# EAGLE design UMN_HASP_2015_GPS-IMU_Board (EAGLE 6.5.0)

## Sheet 1 of 3: GPS
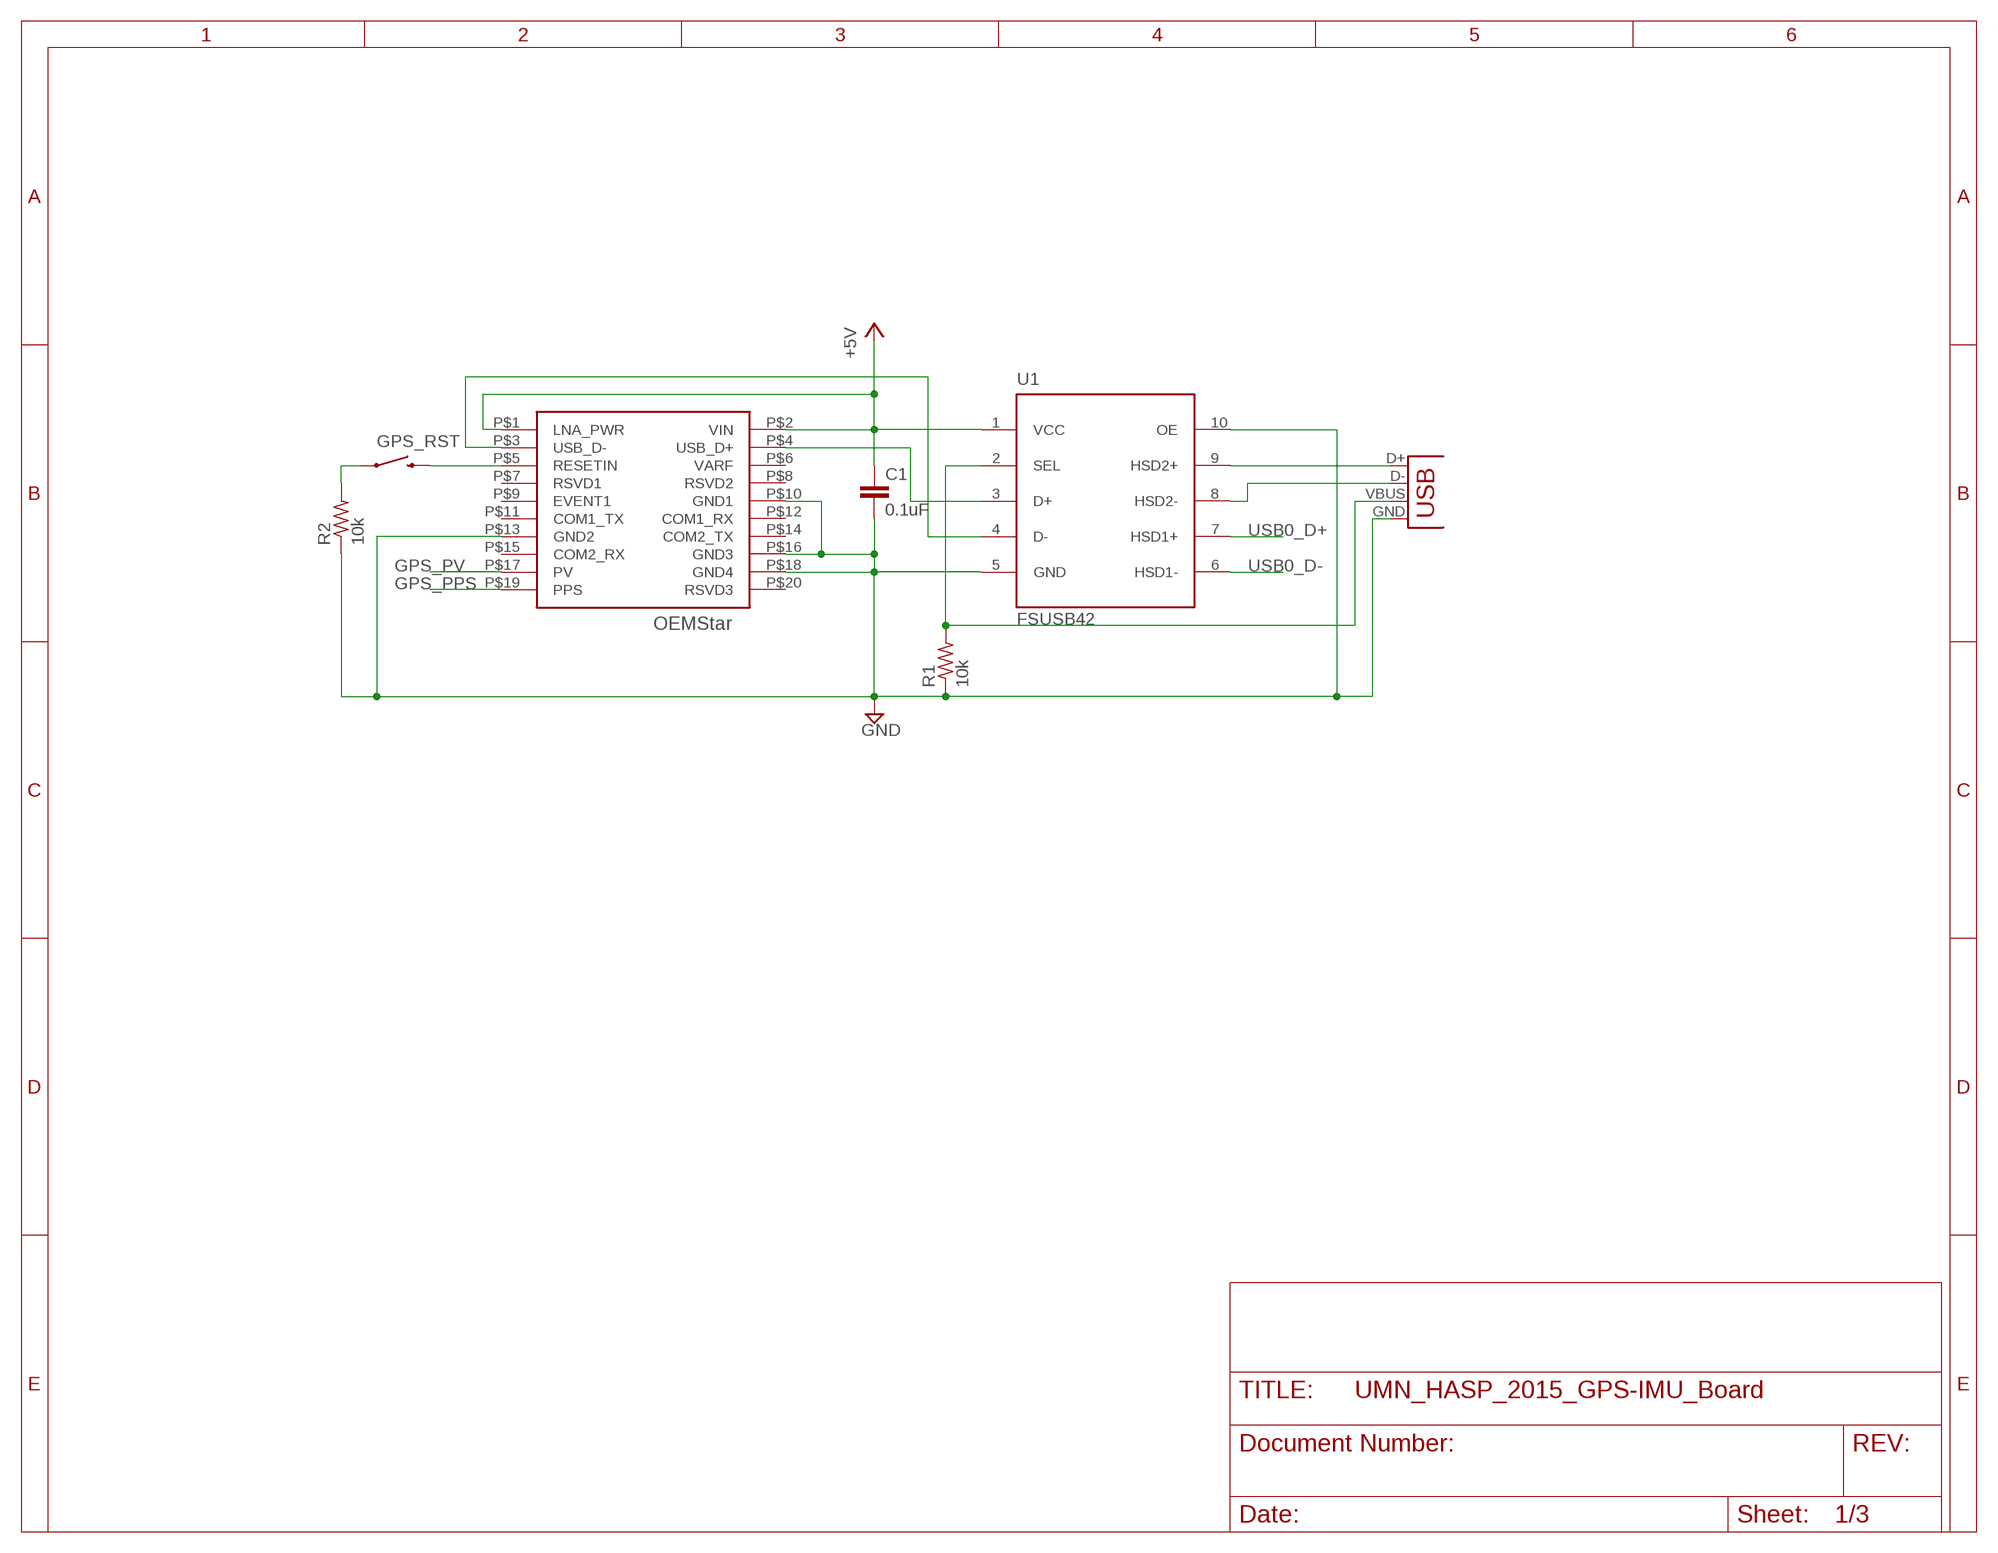
[diagram p0: schematic, sheet 1]

### Parts
C1  0.1uF  C-EUC1206K  [C1206K]
GPS_RST  SWITCH-MOMENTARY-2PTH  [TACTILE-PTH]
J6  USB-B  USBPTH  [USB-B-PTH]
R1  10k  R-US_R1206  [R1206]
R2  10k  R-US_R1206  [R1206]
U1  FSUSB42  [MSOP10]
U$2  OEMSTAR  [OEMSTAR]

### Nets
+5V: C1.1 U1.1(VCC) U$2.P$1(LNA_PWR) U$2.P$2(VIN) ; also sheet 2,3
GND: C1.2 J6.GND R1.1 R2.1 U1.5(GND) U1.10(OE) U$2.P$10(GND1) U$2.P$13(GND2) U$2.P$16(GND3) U$2.P$18(GND4) ; also sheet 2,3
GPS_PPS: U$2.P$19(PPS) ; also sheet 3
GPS_PV: U$2.P$17(PV) ; also sheet 3
N$5: GPS_RST.1 R2.2
N$7: J6.D- U1.8(HSD2-)
N$8: J6.VBUS R1.2 U1.2(SEL)
N$9: GPS_RST.3 U$2.P$5(RESETIN)
N$10: U1.3(D+) U$2.P$4(USB_D+)
N$11: U1.4(D-) U$2.P$3(USB_D-)
N$14: J6.D+ U1.9(HSD2+)
USB0_D+: U1.7(HSD1+) ; also sheet 3
USB0_D-: U1.6(HSD1-) ; also sheet 3
Unconnected: U$2.P$6(VARF) U$2.P$7(RSVD1) U$2.P$8(RSVD2) U$2.P$9(EVENT1) U$2.P$11(COM1_TX) U$2.P$12(COM1_RX) U$2.P$14(COM2_TX) U$2.P$15(COM2_RX) U$2.P$20(RSVD3)

## Sheet 2 of 3: IMU
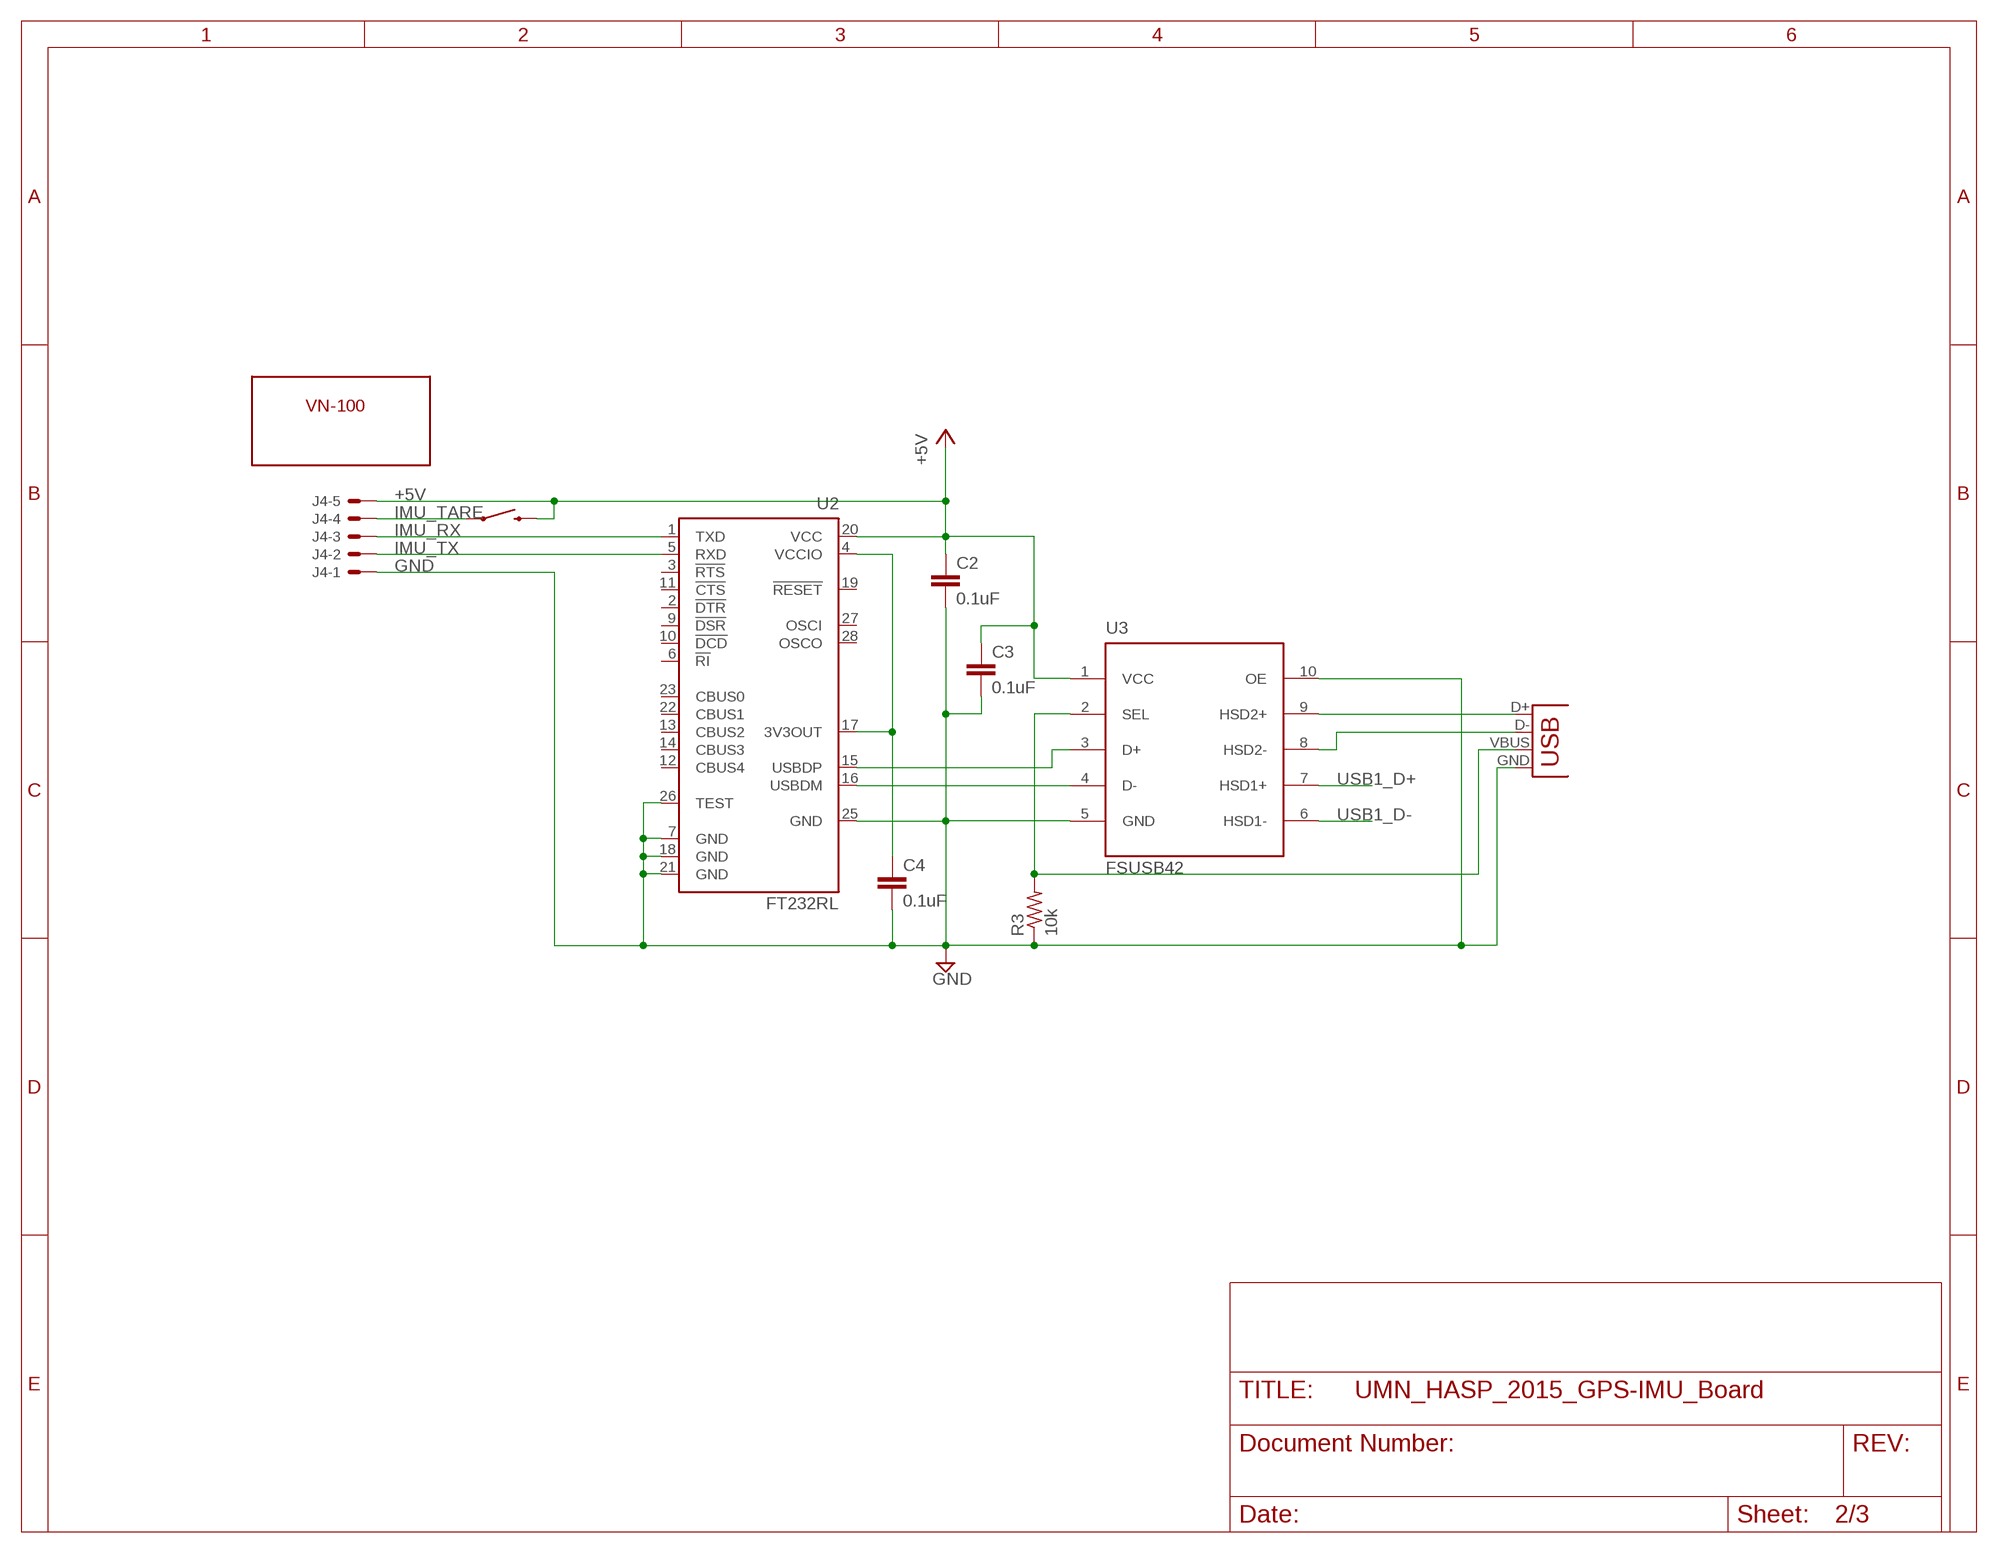
[diagram p1: schematic, sheet 2]

### Parts
C2  0.1uF  C-EUC1206K  [C1206K]
C3  0.1uF  C-EUC1206K  [C1206K]
C4  0.1uF  C-EUC1206K  [C1206K]
IMU_TARE  SWITCH-MOMENTARY-2PTH  [TACTILE-PTH]
J4  C-GRID-05-70553  [70553-05]
J5  USB-B  USBPTH  [USB-B-PTH]
R3  10k  R-US_R1206  [R1206]
U2  FT232RL  [SSOP28]
U3  FSUSB42  [MSOP10]
U$3  VN-100  [VN-100]

### Nets
+5V: C2.1 C3.1 IMU_TARE.3 J4.5 U2.20(VCC) U3.1(VCC) ; also sheet 1,3
GND: C2.2 C3.2 C4.2 J4.1 J5.GND R3.1 U2.7(GND) U2.18(GND) U2.21(GND) U2.25(GND) U2.26(TEST) U3.5(GND) U3.10(OE) ; also sheet 1,3
IMU_RX: J4.3 U2.1(TXD)
IMU_TARE: IMU_TARE.1 J4.4
IMU_TX: J4.2 U2.5(RXD)
N$6: J5.D+ U3.9(HSD2+)
N$12: U2.16(USBDM) U3.4(D-)
N$13: U2.15(USBDP) U3.3(D+)
N$15: J5.D- U3.8(HSD2-)
N$16: J5.VBUS R3.2 U3.2(SEL)
N$17: C4.1 U2.4(VCCIO) U2.17(3V3OUT)
USB1_D+: U3.7(HSD1+) ; also sheet 3
USB1_D-: U3.6(HSD1-) ; also sheet 3
Unconnected: U2.2(!DTR) U2.3(!RTS) U2.6(!RI) U2.9(!DSR) U2.10(!DCD) U2.11(!CTS) U2.12(CBUS4) U2.13(CBUS2) U2.14(CBUS3) U2.19(!RESET) U2.22(CBUS1) U2.23(CBUS0) U2.27(OSCI) U2.28(OSCO)

## Sheet 3 of 3: PC/104
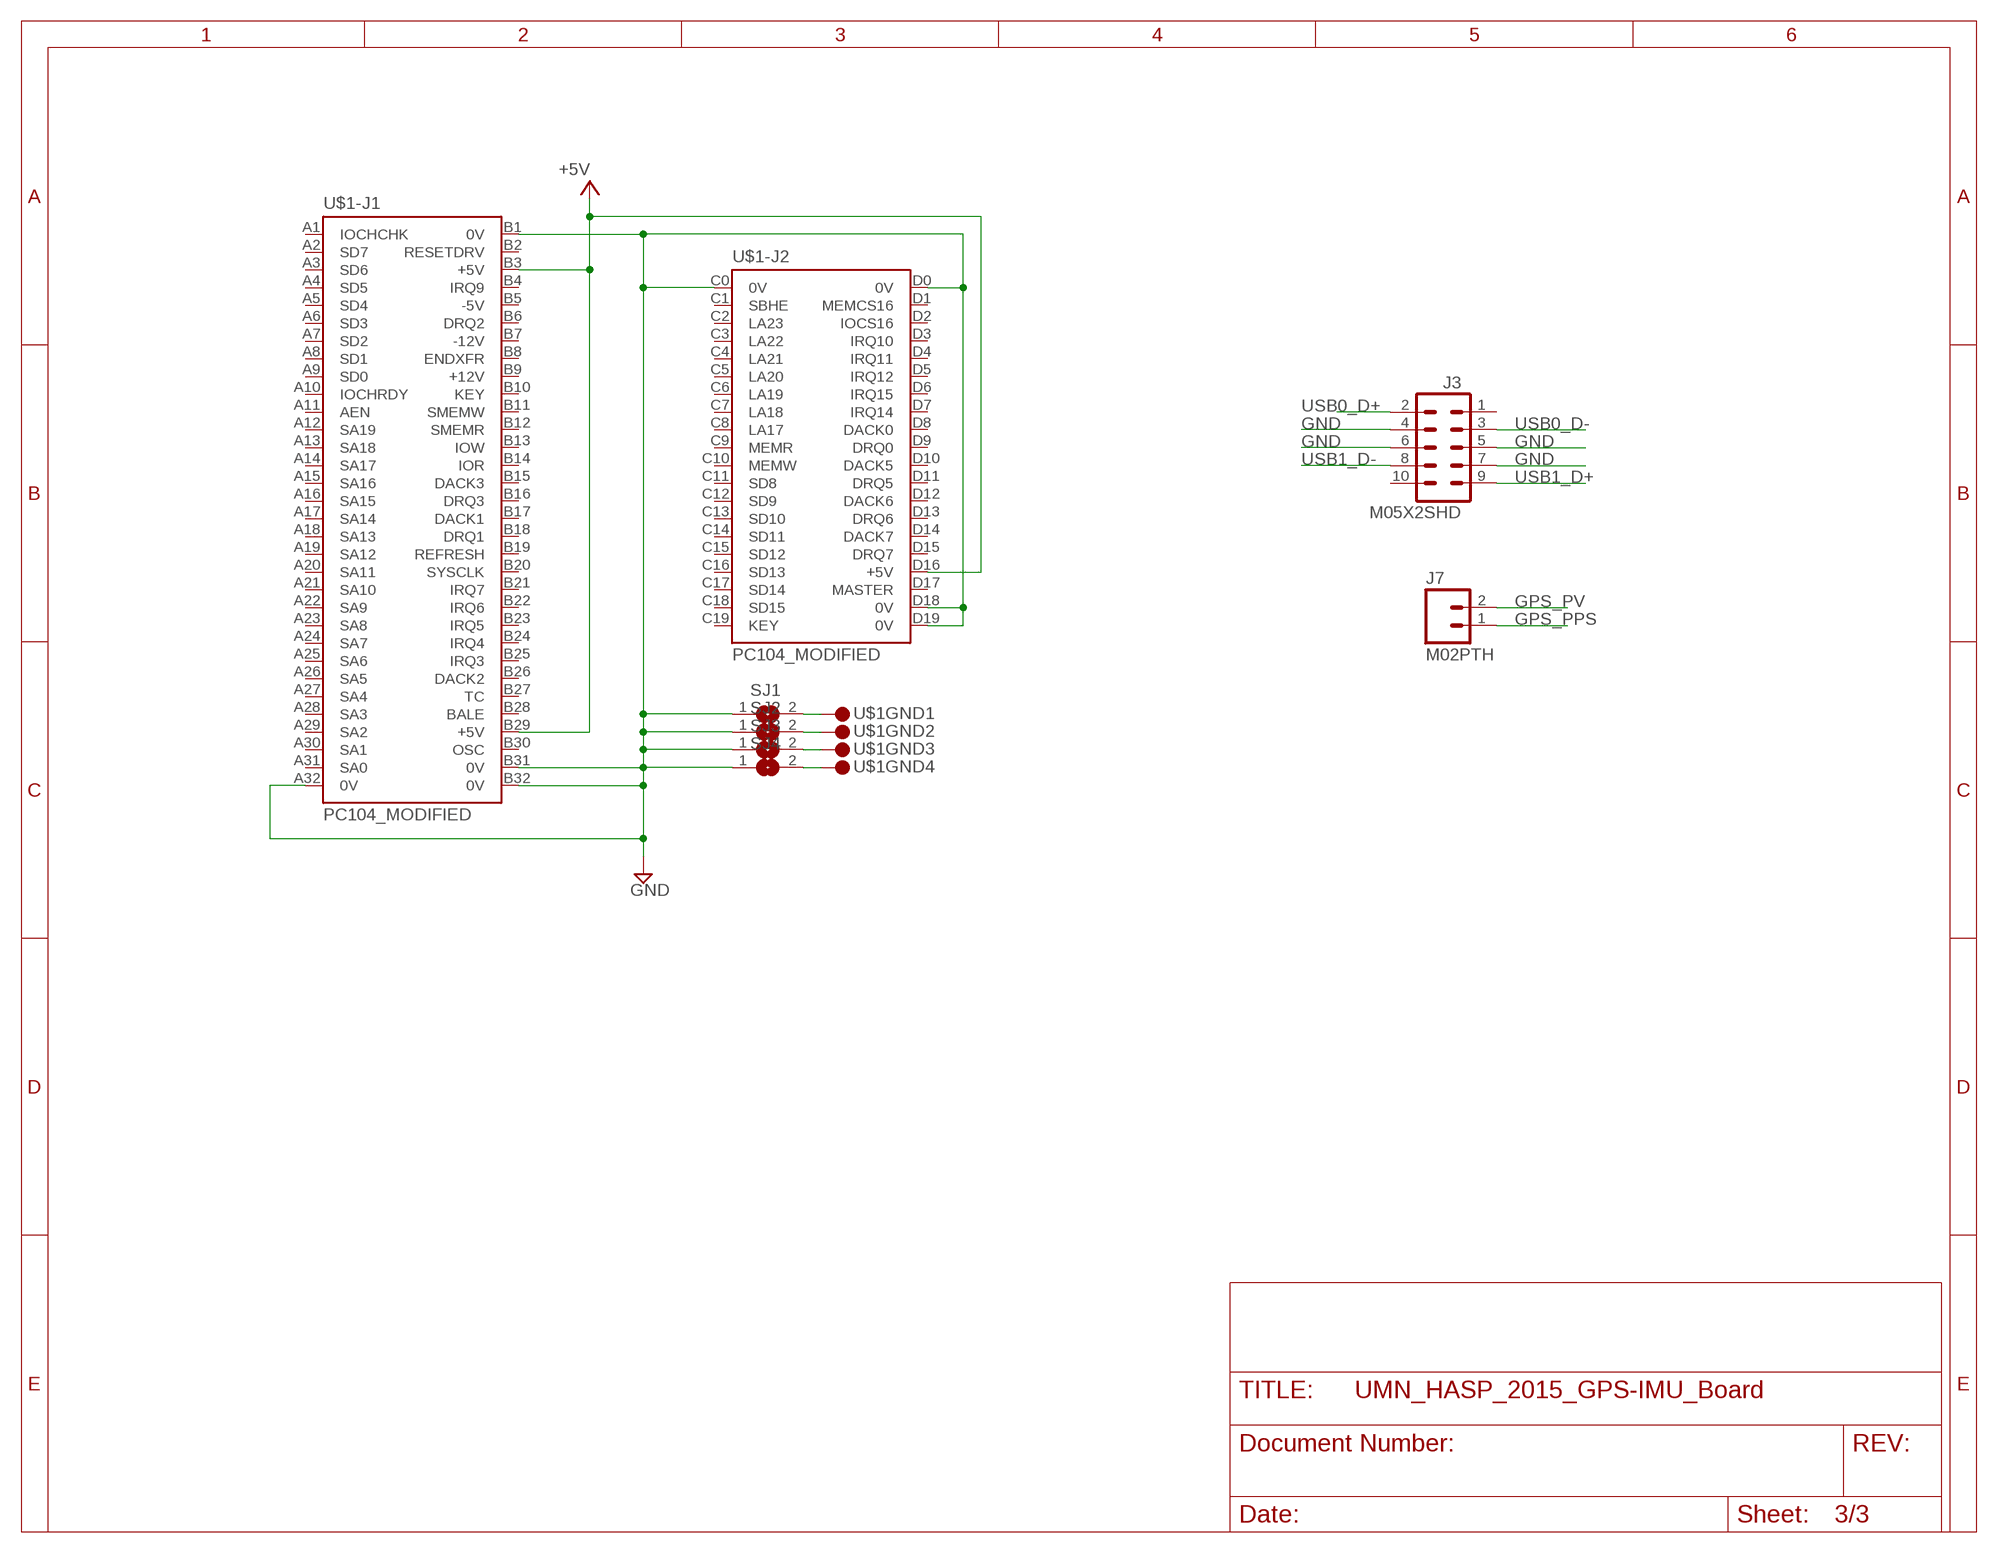
[diagram p2: schematic, sheet 3]

### Parts
J3  M05X2SHD  [2X5-SHROUDED]
J7  M02PTH  [1X02]
SJ1  SJ  [SJ]
SJ2  SJ  [SJ]
SJ3  SJ  [SJ]
SJ4  SJ  [SJ]
U$1  PC104_MODIFIED  [PC104_MODIFIED]

### Nets
+5V: U$1.B3(-J1:+5V) U$1.B29(-J1:+5V) U$1.D16(-J2:+5V) ; also sheet 1,2
GND: J3.4 J3.5 J3.6 J3.7 SJ1.1 SJ2.1 SJ3.1 SJ4.1 U$1.A32(-J1:0V) U$1.B1(-J1:0V) U$1.B31(-J1:0V) U$1.B32(-J1:0V) U$1.C0(-J2:0V) U$1.D0(-J2:0V) U$1.D18(-J2:0V) U$1.D19(-J2:0V) ; also sheet 1,2
GPS_PPS: J7.1 ; also sheet 1
GPS_PV: J7.2 ; also sheet 1
N$1: SJ1.2 U$1.GND@1
N$2: SJ2.2 U$1.GND@2
N$3: SJ3.2 U$1.GND@3
N$4: SJ4.2 U$1.GND@4
USB0_D+: J3.2 ; also sheet 1
USB0_D-: J3.3 ; also sheet 1
USB1_D+: J3.9 ; also sheet 2
USB1_D-: J3.8 ; also sheet 2
Unconnected: J3.1 J3.10 U$1.A1(-J1:IOCHCHK) U$1.A2(-J1:SD7) U$1.A3(-J1:SD6) U$1.A4(-J1:SD5) U$1.A5(-J1:SD4) U$1.A6(-J1:SD3) U$1.A7(-J1:SD2) U$1.A8(-J1:SD1) U$1.A9(-J1:SD0) U$1.A10(-J1:IOCHRDY) U$1.A11(-J1:AEN) U$1.A12(-J1:SA19) U$1.A13(-J1:SA18) U$1.A14(-J1:SA17) U$1.A15(-J1:SA16) U$1.A16(-J1:SA15) U$1.A17(-J1:SA14) U$1.A18(-J1:SA13) U$1.A19(-J1:SA12) U$1.A20(-J1:SA11) U$1.A21(-J1:SA10) U$1.A22(-J1:SA9) U$1.A23(-J1:SA8) U$1.A24(-J1:SA7) U$1.A25(-J1:SA6) U$1.A26(-J1:SA5) U$1.A27(-J1:SA4) U$1.A28(-J1:SA3) U$1.A29(-J1:SA2) U$1.A30(-J1:SA1) U$1.A31(-J1:SA0) U$1.B2(-J1:RESETDRV) U$1.B4(-J1:IRQ9) U$1.B5(-J1:-5V) U$1.B6(-J1:DRQ2) U$1.B7(-J1:-12V) U$1.B8(-J1:ENDXFR) U$1.B9(-J1:+12V) U$1.B10(-J1:KEY) U$1.B11(-J1:SMEMW) U$1.B12(-J1:SMEMR) U$1.B13(-J1:IOW) U$1.B14(-J1:IOR) U$1.B15(-J1:DACK3) U$1.B16(-J1:DRQ3) U$1.B17(-J1:DACK1) U$1.B18(-J1:DRQ1) U$1.B19(-J1:REFRESH) U$1.B20(-J1:SYSCLK) U$1.B21(-J1:IRQ7) U$1.B22(-J1:IRQ6) U$1.B23(-J1:IRQ5) U$1.B24(-J1:IRQ4) U$1.B25(-J1:IRQ3) U$1.B26(-J1:DACK2) U$1.B27(-J1:TC) U$1.B28(-J1:BALE) U$1.B30(-J1:OSC) U$1.C1(-J2:SBHE) U$1.C2(-J2:LA23) U$1.C3(-J2:LA22) U$1.C4(-J2:LA21) U$1.C5(-J2:LA20) U$1.C6(-J2:LA19) U$1.C7(-J2:LA18) U$1.C8(-J2:LA17) U$1.C9(-J2:MEMR) U$1.C10(-J2:MEMW) U$1.C11(-J2:SD8) U$1.C12(-J2:SD9) U$1.C13(-J2:SD10) U$1.C14(-J2:SD11) U$1.C15(-J2:SD12) U$1.C16(-J2:SD13) U$1.C17(-J2:SD14) U$1.C18(-J2:SD15) U$1.C19(-J2:KEY) U$1.D1(-J2:MEMCS16) U$1.D2(-J2:IOCS16) U$1.D3(-J2:IRQ10) U$1.D4(-J2:IRQ11) U$1.D5(-J2:IRQ12) U$1.D6(-J2:IRQ15) U$1.D7(-J2:IRQ14) U$1.D8(-J2:DACK0) U$1.D9(-J2:DRQ0) U$1.D10(-J2:DACK5) U$1.D11(-J2:DRQ5) U$1.D12(-J2:DACK6) U$1.D13(-J2:DRQ6) U$1.D14(-J2:DACK7) U$1.D15(-J2:DRQ7) U$1.D17(-J2:MASTER)

## Library data of the parts
C1-C4 = resistor:C-EU: CAPACITOR, European symbol
GPS_RST IMU_TARE = SparkFun-Electromechanical:SWITCH-MOMENTARY-2: Various NO switches- pushbuttons, reed, etc
J3 = SparkFun-Connectors:M05X2: Header 5x2 Standard 10-pin dual row 0.1" header. Commonly used with AVR-ISP. Use with Spark Fun Electronics SKU: PRT-00778
J4 = con-molex:C-GRID-05: CONNECTOR wire to board 2.54 mm (0.100") pitch header; OC_FARNELL: unknown; OC_NEWARK: unknown
J5 J6 = SparkFun-Connectors:USB: USB Connectors USB-B-PTH is fully proven SKU : PRT-00139/CONN-08278 USB-miniB is fully proven SKU : PRT-00587 USB-A-PCB is untested. USB-A-H is throughly reviewed, but untested. Spark Fun Electronics SKU : PRT-00437 USB-B-SMT is throughly reviewed, but untested. Needs silkscreen touching up. USB-A-S has not been used/tested USB-MB-H has not been used/tested USB-MICROB has been used. CONN-09505; PROD_ID: CONN-08278
J7 = SparkFun-Connectors:M02: Standard 2-pin 0.1" header. Use with - straight break away headers ( PRT-00116) - right angle break away headers (PRT-00553) - swiss pins (PRT-00743) - machine pins (PRT-00117) - female headers (PRT-00115) Molex polarized connector foot print use with: PRT-08233 with associated crimp pins and housings. 2.54_SCREWTERM for use with PRT-10571. 3.5mm Screw Terminal footprints for PRT-08084 5mm Screw Terminal footprints for use with PRT-08433
R1-R3 = resistor:R-US_: RESISTOR, American symbol
SJ1-SJ4 = jumper:SJ: SMD solder JUMPER
U1 U3 = HAXDT_CUSTOM:FSUSB42
U2 = ftdichip:FT232R: Source: http://www.ftdichip.com/Documents/DataSheets/DS_FT232R_v104.pdf; MPN: FT232RL; OC_FARNELL: 1146032; OC_NEWARK: 91K9918
U$1 = con-pc104:PC104_MODIFIED
U$2 = HAXDT_CUSTOM:OEMSTAR
U$3 = HAXDT_CUSTOM:VN-100

## Board
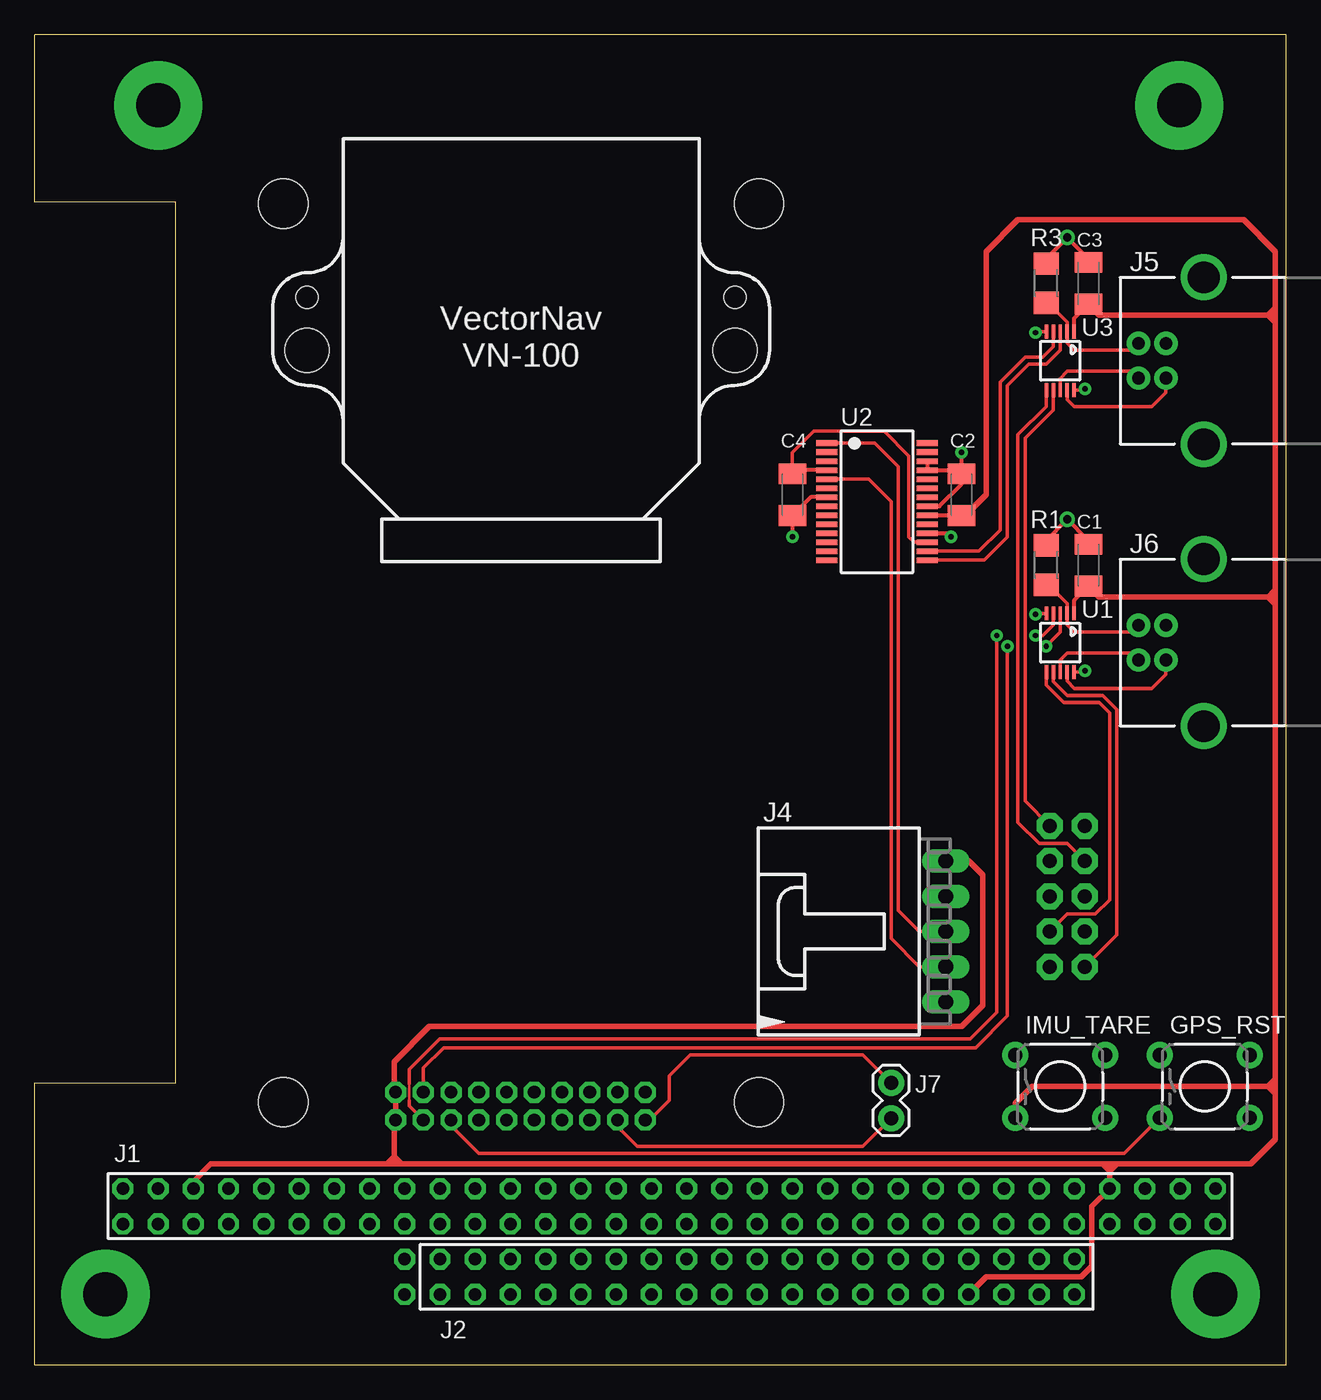
[diagram p3: board, top side]
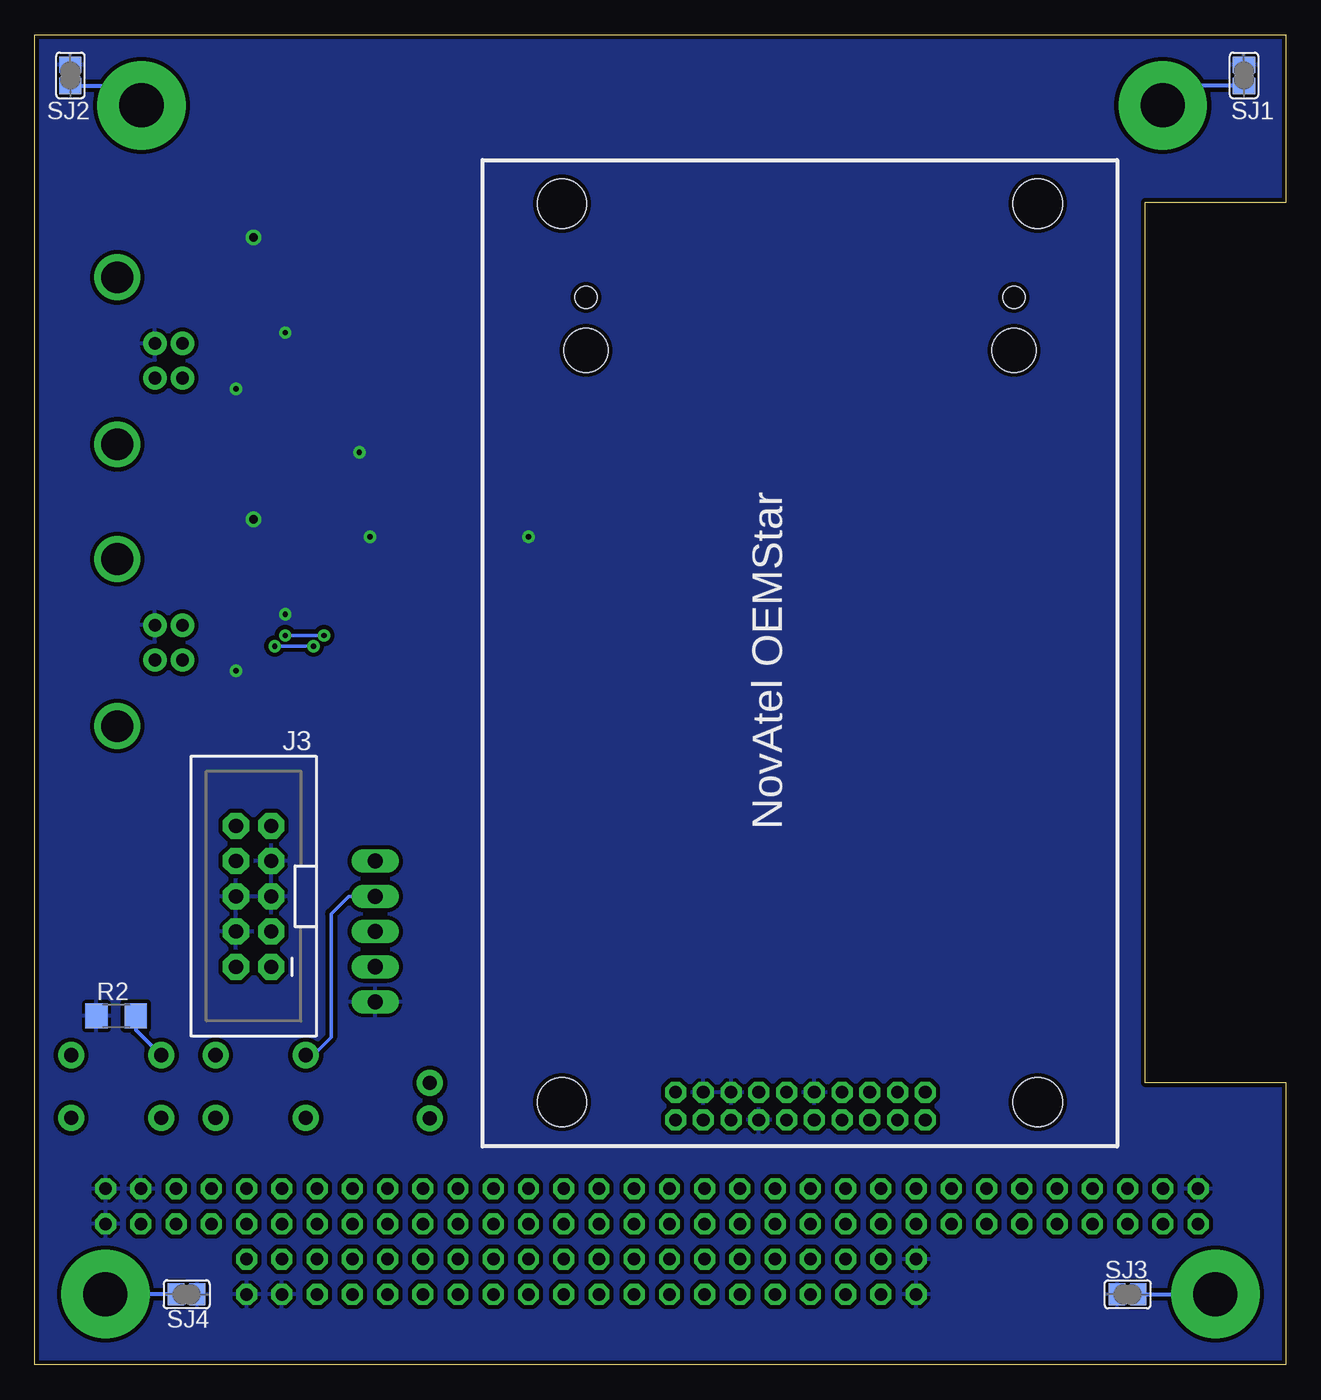
[diagram p4: board, bottom side, seen from below]

Size 90.2 x 95.9 mm. Coordinates in mm from the lower left corner, seen from the top.
Copper layers (1*16): Top 0.035mm / dielectric 1.5mm / Bottom 0.035mm
Design rules "AdvancedCircuits *": minimum track width 6mil, minimum drill 15mil, track to track 6mil, track to pad 6mil, pad to pad 6mil, via to via 6mil, smd to smd 6mil, copper to edge 10mil, drill to drill 6mil, minimum pad ring 12mil, minimum via ring 10mil, stop-mask expansion 5mil, vias tented up to drill 25mil, thermal gap 10mil

### Footprints (pad centres in the part's own frame; a part is rotated, then mirrored left to right if it is on the bottom)
C1206K = smd 1.5 x 2: 1 -1.5,0; 2 1.5,0
TACTILE-PTH = drill 1.016 pad 1.88: 1 -3.251,2.261; 2 3.251,2.261; 3 -3.251,-2.261; 4 3.251,-2.261
2X5-SHROUDED = drill 1.016 pad 1.88 octagon: 1 -1.27,5.08; 2 1.27,5.08; 3 -1.27,2.54; 4 1.27,2.54; 5 -1.27,0; 6 1.27,0; 7 -1.27,-2.54; 8 1.27,-2.54; 9 -1.27,-5.08; 10 1.27,-5.08
70553-05 = drill 1.092 long: 1 -5.08,-7.62; 2 -2.54,-7.62; 3 0,-7.62; 4 2.54,-7.62; 5 5.08,-7.62
USB-B-PTH = drill 0.914 pad 1.676: D+ 0,1.25; D- 1.981,1.25; GND 0,-1.25; VBUS 1.981,-1.25 | drill 2.286: S1 -2.718,-6.02; S2 -2.718,6.02
1X02 = drill 1.016 pad 1.88: 1 0,0; 2 2.54,0
R1206 = smd 1.6 x 1.803: 1 -1.422,0; 2 1.422,0
SJ = smd 1.168 x 1.6: 1 -0.762,0; 2 0.762,0
MSOP10 = smd 0.25 x 1: 1 -1,-2.113; 2 -0.5,-2.113; 3 0,-2.113; 4 0.5,-2.113; 5 1,-2.113; 6 1,2.113; 7 0.5,2.113; 8 0,2.113; 9 -0.5,2.113; 10 -1,2.113
SSOP28 = smd 0.4 x 1.5: 1 -4.225,-3.625; 2 -3.575,-3.625; 3 -2.925,-3.625; 4 -2.275,-3.625; 5 -1.625,-3.625; 6 -0.975,-3.625; 7 -0.325,-3.625; 8 0.325,-3.625; 9 0.975,-3.625; 10 1.625,-3.625; 11 2.275,-3.625; 12 2.925,-3.625; 13 3.575,-3.625; 14 4.225,-3.625; 15 4.225,3.625; 16 3.575,3.625; 17 2.925,3.625; 18 2.275,3.625; 19 1.625,3.625; 20 0.975,3.625; 21 0.325,3.625; 22 -0.325,3.625; 23 -0.975,3.625; 24 -1.625,3.625; 25 -2.275,3.625; 26 -2.925,3.625; 27 -3.575,3.625; 28 -4.225,3.625
PC104_MODIFIED = drill 0.9 pad 1.397 octagon: A1 6.35,10.16; A2 8.89,10.16; A3 11.43,10.16; A4 13.97,10.16; A5 16.51,10.16; A6 19.05,10.16; A7 21.59,10.16; A8 24.13,10.16; A9 26.67,10.16; A10 29.21,10.16; A11 31.75,10.16; A12 34.29,10.16; A13 36.83,10.16; A14 39.37,10.16; A15 41.91,10.16; A16 44.45,10.16; A17 46.99,10.16; A18 49.53,10.16; A19 52.07,10.16; A20 54.61,10.16; A21 57.15,10.16; A22 59.69,10.16; A23 62.23,10.16; A24 64.77,10.16; A25 67.31,10.16; A26 69.85,10.16; A27 72.39,10.16; A28 74.93,10.16; A29 77.47,10.16; A30 80.01,10.16; A31 82.55,10.16; A32 85.09,10.16; B1 6.35,12.7; B2 8.89,12.7; B3 11.43,12.7; B4 13.97,12.7; B5 16.51,12.7; B6 19.05,12.7; B7 21.59,12.7; B8 24.13,12.7; B9 26.67,12.7; B10 29.21,12.7; B11 31.75,12.7; B12 34.29,12.7; B13 36.83,12.7; B14 39.37,12.7; B15 41.91,12.7; B16 44.45,12.7; B17 46.99,12.7; B18 49.53,12.7; B19 52.07,12.7; B20 54.61,12.7; B21 57.15,12.7; B22 59.69,12.7; B23 62.23,12.7; B24 64.77,12.7; B25 67.31,12.7; B26 69.85,12.7; B27 72.39,12.7; B28 74.93,12.7; B29 77.47,12.7; B30 80.01,12.7; B31 82.55,12.7; B32 85.09,12.7; C0 26.67,7.62; C1 29.21,7.62; C2 31.75,7.62; C3 34.29,7.62; C4 36.83,7.62; C5 39.37,7.62; C6 41.91,7.62; C7 44.45,7.62; C8 46.99,7.62; C9 49.53,7.62; C10 52.07,7.62; C11 54.61,7.62; C12 57.15,7.62; C13 59.69,7.62; C14 62.23,7.62; C15 64.77,7.62; C16 67.31,7.62; C17 69.85,7.62; C18 72.39,7.62; C19 74.93,7.62; D0 26.67,5.08; D1 29.21,5.08; D2 31.75,5.08; D3 34.29,5.08; D4 36.83,5.08; D5 39.37,5.08; D6 41.91,5.08; D7 44.45,5.08; D8 46.99,5.08; D9 49.53,5.08; D10 52.07,5.08; D11 54.61,5.08; D12 57.15,5.08; D13 59.69,5.08; D14 62.23,5.08; D15 64.77,5.08; D16 67.31,5.08; D17 69.85,5.08; D18 72.39,5.08; D19 74.93,5.08 | drill 3.175 pad 6.35: GND@1 8.9,90.8; GND@2 82.5,90.8; GND@3 5.1,5.1; GND@4 85.1,5.1
OEMSTAR = drill 0.914 octagon: P$1 33.655,-9.042; P$2 31.655,-9.042; P$3 33.655,-7.042; P$4 31.655,-7.042; P$5 33.655,-5.042; P$6 31.655,-5.042; P$7 33.655,-3.042; P$8 31.655,-3.042; P$9 33.655,-1.042; P$10 31.655,-1.042; P$11 33.655,0.958; P$12 31.655,0.958; P$13 33.655,2.958; P$14 31.655,2.958; P$15 33.655,4.958; P$16 31.655,4.958; P$17 33.655,6.958; P$18 31.655,6.958; P$19 33.655,8.958; P$20 31.655,8.958 | hole 3.556: -32.41,-17.145; -32.41,17.145; 32.36,17.145; 32.36,-17.145
VN-100 = hole 3.175: -15.418,3.556; 15.418,3.556 | hole 1.6: -15.418,-0.254; 15.418,-0.254

### Placement (x,y rotation side)
C1  75.95,57.66 90 top
C2  66.8,62.74 90 top
C3  75.95,77.98 90 top
C4  54.61,62.74 270 top
GPS_RST  84.33,20.07 0 top
IMU_TARE  73.91,20.07 0 top
J3  74.42,33.78 180 bottom
J4  58.04,31.24 90 top
J5  81.53,72.39 180 top
J6  81.53,52.07 180 top
J7  61.72,20.32 270 top
R1  72.9,57.66 270 top
R2  84.33,25.15 0 bottom
R3  72.9,77.98 270 top
SJ1  3.05,92.96 270 bottom
SJ2  87.63,92.96 270 bottom
SJ3  11.43,5.08 0 bottom
SJ4  79.25,5.08 180 bottom
U1  73.91,52.07 180 top
U2  60.71,62.23 270 top
U3  73.91,72.39 180 top
U$1  0,0 0 top
U$2  35.05,51.31 270 top
U$3  35.05,76.71 180 top

### Tracks (layer width: path | path; a pad name or v marks a point on that pad's centre or on a via)
+5V
  Top 0.305: U3.1 74.91,75.45 C3.1 | U1.1 74.91,55.1 74.93,55.12 74.93,55.14 C1.1 | C2.1 64.35,61.24 U2.20
  Top 0.406: J4.5 67.31,36.32 68.33,35.31 68.33,25.91 66.8,24.38 28.45,24.38 25.91,21.84 25.91,19.75 U$2.P$2 U$2.P$1 25.91,17.55 25.91,14.99 | U$1.B3 11.43,13.21 12.7,14.48 25.4,14.48 | U$1.D16 68.58,6.35 75.44,6.35 76.2,7.11 76.2,11.43 U$1.B29 77.47,13.97 | IMU_TARE.3 70.66,18.85 71.88,20.07 88.9,20.07 | 88.9,20.07 89.41,20.07 | 89.41,19.56 89.41,16.26 87.63,14.48 77.98,14.48 | 89.41,19.56 89.41,20.07 | 25.4,14.48 25.91,14.48 | 25.91,14.48 26.42,14.48 | 26.42,14.48 76.96,14.48 | 76.96,14.48 77.47,14.48 | 77.98,14.48 77.72,14.48 77.47,14.48 | 25.91,14.99 25.91,14.48 | 25.91,14.99 26.42,14.48 | 25.91,14.99 25.4,14.48 | 77.47,13.97 77.47,14.48 | 77.47,13.97 76.96,14.48 | 77.47,13.97 77.98,14.48 | 89.41,20.07 89.41,20.57 | 89.41,20.57 89.41,54.86 | 89.41,54.86 89.41,55.37 | 89.41,55.37 89.41,55.88 | 89.41,55.88 89.41,75.18 | 89.41,75.18 89.41,75.95 | 89.41,75.95 89.41,76.2 | 89.41,76.2 89.41,80.26 87.12,82.55 70.87,82.55 68.58,80.26 68.58,62.74 67.08,61.24 C2.1 | 88.9,20.07 89.41,19.56 | 88.9,20.07 89.41,20.57 | 88.9,55.37 76.73,55.37 C1.1 | 88.9,55.37 89.41,55.37 | 88.9,55.37 89.41,54.86 | 88.9,55.37 89.41,55.88 | C3.1 75.92,76.48 76.71,75.69 88.9,75.69 | 88.9,75.69 89.15,75.69 89.41,75.95 | 88.9,75.69 89.41,75.18 | 88.9,75.69 89.41,76.2
GND  (via drill 0.38, 0.6)
  Top 0.254: U3.5 72.22,74.5 v72.14,74.42 | U3.10 75.61,70.28 v75.69,70.36 | U1.10 75.61,49.96 v75.69,50.04 | U1.5 72.22,54.18 v72.14,54.1
  Top 0.305: U2.18 65.78,59.95 v66.04,59.69 | C2.2 v66.8,65.79 | C2.2 66.53,64.5 U2.25 U2.26 | U2.21 65.21,61.91 66.8,63.5 C2.2 | v54.61,59.69 C4.2 55.93,62.55 U2.7 | C1.2 75.95,59.44 v74.42,60.96 72.9,59.44 R1.1 | C3.2 75.95,79.76 v74.42,81.28 72.9,79.76 R3.1
  pour Bottom (isolate 0.305): 0,0 90.17,0 90.17,96.01 0,96.01 0,83.82 10.16,83.82 10.16,20.32 0,20.32
GPS_PPS
  Top 0.254: J7.1 59.69,22.35 47.24,22.35 45.72,20.83 45.72,19.05 44.32,17.65 U$2.P$19
GPS_PV
  Top 0.254: U$2.P$17 42.01,17.17 43.43,15.75 59.69,15.75 J7.2
IMU_RX
  Top 0.254: U2.1 60.55,66.45 62.23,64.77 62.23,32.77 63.75,31.24 J4.3
IMU_TARE
  Bottom 0.254: J4.4 67.56,33.78 68.83,32.51 68.83,23.62 70.1,22.35 70.64,22.35 IMU_TARE.1
IMU_TX
  Top 0.254: U2.5 60.1,63.85 61.72,62.23 61.72,30.73 63.75,28.7 J4.2
N$1
  Bottom 0.305: SJ1.2 7.5,92.2 U$1.GND@1
N$2
  Bottom 0.305: SJ2.2 83.9,92.2 U$1.GND@2
N$3
  Bottom 0.305: SJ3.2 5.12,5.08 U$1.GND@3
N$4
  Bottom 0.305: SJ4.2 85.08,5.08 U$1.GND@4
N$5
  Bottom 0.305: R2.2 82.91,24.16 GPS_RST.1
N$6
  Top 0.254: U3.9 74.41,69.6 74.93,69.09 80.52,69.09 81.53,70.1 J5.D+
N$7
  Top 0.254: U1.8 73.91,50.8 74.42,51.31 79.06,51.31 J6.D-
N$8
  Top 0.254: J6.VBUS 79.06,52.83 74.93,52.83 74.41,53.35 U1.2 74.41,54.87 73.41,55.88 73.25,55.88 R1.2
N$9
  Top 0.254: U$2.P$5 30.01,17.23 32,15.24 78.51,15.24 GPS_RST.3
N$10  (via drill 0.38)
  Top 0.254: U$2.P$4 28.01,21.41 29.46,22.86 67.82,22.86 70.1,25.15 v70.1,51.82 | v72.9,51.82 73.91,52.83 U1.3
  Bottom 0.254: v70.1,51.82 v72.9,51.82
N$11  (via drill 0.38)
  Top 0.165: 27.01,20.24 27.01,19.05
  Top 0.254: v72.14,52.58 72.64,52.58 73.41,53.34 U1.4 | v69.34,52.58 69.34,25.4 67.44,23.5 29.21,23.5 27.01,21.29 27.01,20.24 | U$2.P$3 27.01,18.66 27.01,19.05
  Bottom 0.254: v69.34,52.58 v72.14,52.58
N$12
  Top 0.254: U2.16 68.05,58.66 69.6,60.2 69.6,70.87 71.37,72.64 72.64,72.64 73.41,73.41 U3.4
N$13
  Top 0.254: U2.15 68.42,58.01 70.1,59.69 70.1,70.61 71.63,72.14 72.9,72.14 73.91,73.15 U3.3
N$14
  Top 0.254: U1.9 74.41,49.28 74.93,48.77 80.52,48.77 81.53,49.78 J6.D+
N$15
  Top 0.254: U3.8 73.91,71.12 74.42,71.63 79.06,71.63 J5.D-
N$16
  Top 0.254: J5.VBUS 79.06,73.15 74.93,73.15 74.41,73.67 U3.2 74.41,75.19 73.66,75.95 73.51,75.95 R3.2
N$17
  Top 0.254: U2.17 63.38,59.3 62.99,59.69 62.99,65.53 61.21,67.31 56.13,67.31 54.61,65.79 C4.1
  Top 0.305: U2.4 54.88,64.5 C4.1
USB0_D+
  Top 0.254: J3.2 77.98,30.99 77.98,47.24 76.96,48.26 74.42,48.26 73.41,49.28 73.41,49.95 U1.7
USB0_D-
  Top 0.254: J3.3 74.42,32.51 76.45,32.51 77.47,33.53 77.47,46.99 76.71,47.75 74.17,47.75 72.9,49.02 72.9,49.94 U1.6
USB1_D+
  Top 0.254: J3.9 71.37,40.64 71.37,66.8 73.41,68.83 U3.7
USB1_D-
  Top 0.254: J3.8 74.42,37.59 72.39,37.59 70.87,39.12 70.87,67.06 72.9,69.09 72.9,70.26 U3.6

### Text on the board
Document: University of Minnesota HASP / GPS and IMU Mounting Board | 2015 Rev 1.0